# EAGLE design mMicroSD (EAGLE 7.2.0)
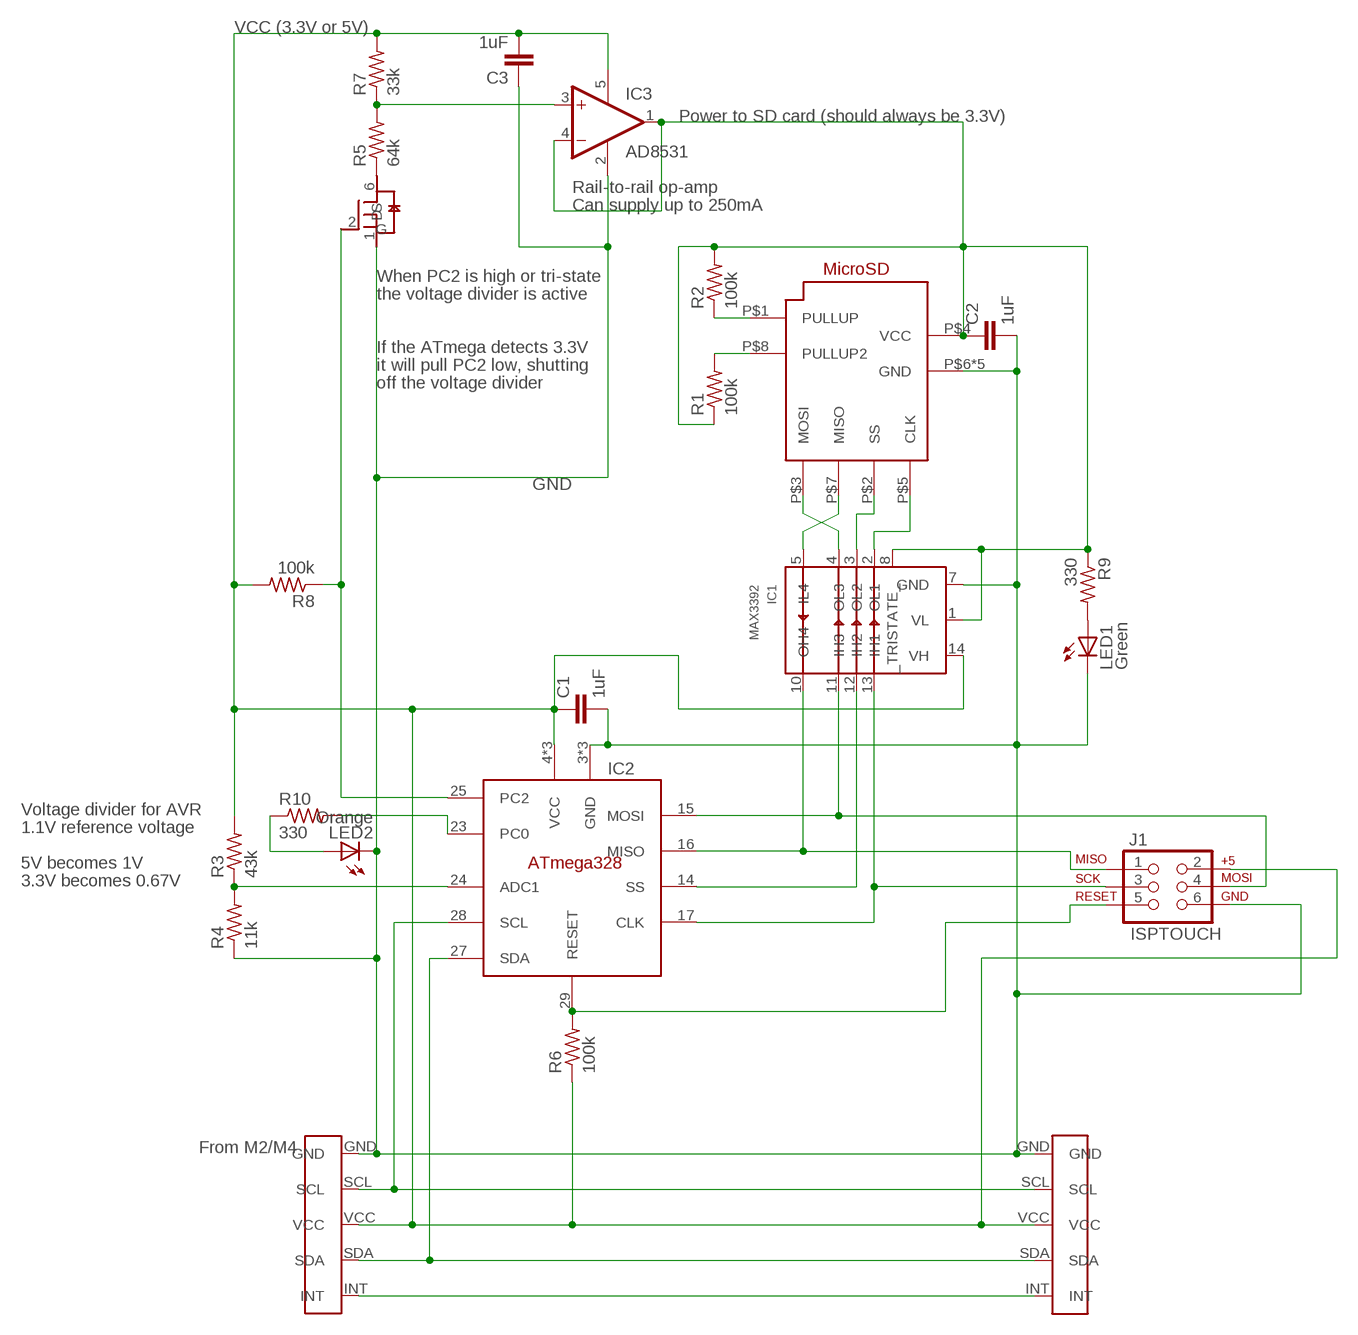
[diagram p0: schematic, sheet 1]

## Parts
C1  1uF  C-EUC0603  [C0603]
C2  1uF  C-EUC0603  [C0603]
C3  1uF  C-EUC0603  [C0603]
IC1  MAX3392  [14-TSSOP]
IC2  ATMEGA328  [ATMEGA328]
IC3  AD8531  [SOT-23-5]
J1  ISPTOUCH  ISPTOUCH_ADAPTER  [AVX_9188_6-WAY_SMT]
LED1  Green  LEDSML0603  [SML0603]
LED2  Orange  LEDSML0603  [SML0603]
M1  NTJD5121N  NTJD5121NT1G  [SOT-363]
R1  100k  R-US_R0603  [R0603]
R2  100k  R-US_R0603  [R0603]
R3  43k  R-US_R0603  [R0603]
R4  11k  R-US_R0603  [R0603]
R5  64k  R-US_R0603  [R0603]
R6  100k  R-US_R0603  [R0603]
R7  33k  R-US_R0603  [R0603]
R8  100k  R-US_R0603  [R0603]
R9  330  R-US_R0603  [R0603]
R10  330  R-US_R0603  [R0603]
SDCONN  101-00660-68-6  [101-00660-68-6]
U$1  MBUS_OUT  [MBUS_OUT]
U$2  MBUS_IN  [MBUS_IN]

## Nets
ADC_LINE: IC2.24(ADC1) R3.1 R4.2
DATA_LED: IC2.23(PC0) R10.2
GATE: IC2.25(PC2) M1.2(G) R8.1
GND: C1.2 C2.2 C3.1 IC1.7(GND) IC2.3(GND) IC2.5(GND) IC2.21(GND) IC3.2(V-) J1.6 LED1.C LED2.C M1.1(S) R4.1 SDCONN.P$6(GND) SDCONN.P$9(GND) SDCONN.P$10(GND) SDCONN.P$11(GND) SDCONN.P$12(GND) U$1.GND U$2.GND
INT: U$1.INT U$2.INT
MISO: IC1.10(OH4) IC2.16(MISO) J1.1
MOSI: IC1.11(IH3) IC2.15(MOSI) J1.4
N$1: M1.6(D) R5.1
N$2: LED1.A R9.2
N$4: LED2.A R10.1
N$12: R1.2 SDCONN.P$8(PULLUP2)
N$13: R2.1 SDCONN.P$1(PULLUP)
OPAMP_VOLTAGE: IC3.3(+IN) R5.2 R7.1
RESET: IC2.29(RESET) J1.5 R6.2
SCK: IC1.13(IH1) IC2.17(CLK) J1.3
SCL: IC2.28(SCL) U$1.SCL U$2.SCL
SD_CS: IC1.3(OL2) SDCONN.P$2(SS)
SD_MISO: IC1.5(IL4) SDCONN.P$7(MISO)
SD_MOSI: IC1.4(OL3) SDCONN.P$3(MOSI)
SD_SCK: IC1.2(OL1) SDCONN.P$5(CLK)
SDA: IC2.27(SDA) U$1.SDA U$2.SDA
SS: IC1.12(IH2) IC2.14(SS)
VCC_MBUS: C1.1 C3.2 IC1.14(VH) IC2.4(VCC) IC2.6(VCC) IC2.18(VCC) IC3.5(V+) J1.2 R3.2 R6.1 R7.2 R8.2 U$1.VCC U$2.VCC
VCC_SD: C2.1 IC1.1(VL) IC1.8(_TRISTATE_) IC3.1(OUT) IC3.4(-IN) R1.1 R2.2 R9.1 SDCONN.P$4(VCC)
Unconnected: M1.3(D) M1.4(S) M1.5(G)

## Notes on the sheet
- VCC (3.3V or 5V)
- Power to SD card (should always be 3.3V)
- Rail-to-rail op-amp
- Can supply up to 250mA
- When PC2 is high or tri-state
- the voltage divider is active
- If the ATmega detects 3.3V
- it will pull PC2 low, shutting
- off the voltage divider
- Voltage divider for AVR
- 1.1V reference voltage
- 5V becomes 1V
- 3.3V becomes 0.67V
- From M2/M4

## Library data of the parts
C1-C3 = resistor:C-EU: CAPACITOR, European symbol
IC1 = haptics:MAX3392: 16Mbps level translator 3 high-to-low 1 low-to-high Min 1.2V Max 5.5V
IC2 = zz-kent:ATMEGA328
IC3 = haptics:AD8531: Rail-to-rail op amp, 2.7V to 6V supply difference, 250mA output
J1 = daspilker_ISPtouch:ISPTOUCH: ISPtouch for AVR Microcontrollers This 6-pin ISP connector for AVR programming does not require any part on the PCB, but an adapter for a common 6-pin programmer. http://daniel-spilker.com/blog/2011/04/25/isptouch-for-avr-microcontrollers/
LED1 LED2 = led:LED: LED OSRAM: - CHIPLED LG R971, LG N971, LY N971, LG Q971, LY Q971, LO R971, LY R971 LH N974, LH R974 LS Q976, LO Q976, LY Q976 LO Q996 - Hyper CHIPLED LW Q18S LB Q993, LB Q99A, LB R99A - SideLED LS A670, LO A670, LY A670, LG A670, LP A670 LB A673, LV A673, LT A673, LW A673 LH A674 LY A675 LS A676, LA A676, LO A676, LY A676, LW A676 LS A679, LY A679, LG A679 - Hyper Micro SIDELED® LS Y876, LA Y876, LO Y876, LY Y876 LT Y87S - SmartLED LW L88C, LW L88S LB L89C, LB L89S, LG L890 LS L89K, LO L89K, LY L89K LS L896, LA L896, LO L896, LY L896 - TOPLED LS T670, LO T670, LY T670, LG T670, LP T670 LSG T670, LSP T670, LSY T670, LOP T670, LYG T670 LG T671, LOG T671, LSG T671 LB T673, LV T673, LT T673, LW T673 LH T674 LS T676, LA T676, LO T676, LY T676, LB T676, LH T676, LSB T676, LW T676 LB T67C, LV T67C, LT T67C, LS T67K, LO T67K, LY T67K, LW E67C LS E67B, LA E67B, LO E67B, LY E67B, LB E67C, LV E67C, LT E67C LW T67C LS T679, LY T679, LG T679 LS T770, LO T770, LY T770, LG T770, LP T770 LB T773, LV T773, LT T773, LW T773 LH T774 LS E675, LA E675, LY E675, LS T675 LS T776, LA T776, LO T776, LY T776, LB T776 LHGB T686 LT T68C, LB T68C - Hyper Mini TOPLED® LB M676 - Mini TOPLED Santana® LG M470 LS M47K, LO M47K, LY M47K Source: http://www.osram.convergy.de LUXEON: - LUMILED® LXK2-PW12-R00, LXK2-PW12-S00, LXK2-PW14-U00, LXK2-PW14-V00 LXK2-PM12-R00, LXK2-PM12-S00, LXK2-PM14-U00 LXK2-PE12-Q00, LXK2-PE12-R00, LXK2-PE12-S00, LXK2-PE14-T00, LXK2-PE14-U00 LXK2-PB12-K00, LXK2-PB12-L00, LXK2-PB12-M00, LXK2-PB14-N00, LXK2-PB14-P00, LXK2-PB14-Q00 LXK2-PR12-L00, LXK2-PR12-M00, LXK2-PR14-Q00, LXK2-PR14-R00 LXK2-PD12-Q00, LXK2-PD12-R00, LXK2-PD12-S00 LXK2-PH12-R00, LXK2-PH12-S00 LXK2-PL12-P00, LXK2-PL12-Q00, LXK2-PL12-R00 Source: www.luxeon.com KINGBRIGHT: KA-3528ASYC Source: www.kingbright.com
M1 = haptics:NTJD5121NT1G: Dual 60V N-channel MOSFETs
R1-R10 = resistor:R-US_: RESISTOR, American symbol
SDCONN = zz-kent:101-00660-68-6: MicroSD connector
U$1 = zz-kent:MBUS_OUT
U$2 = zz-kent:MBUS_IN

## Board
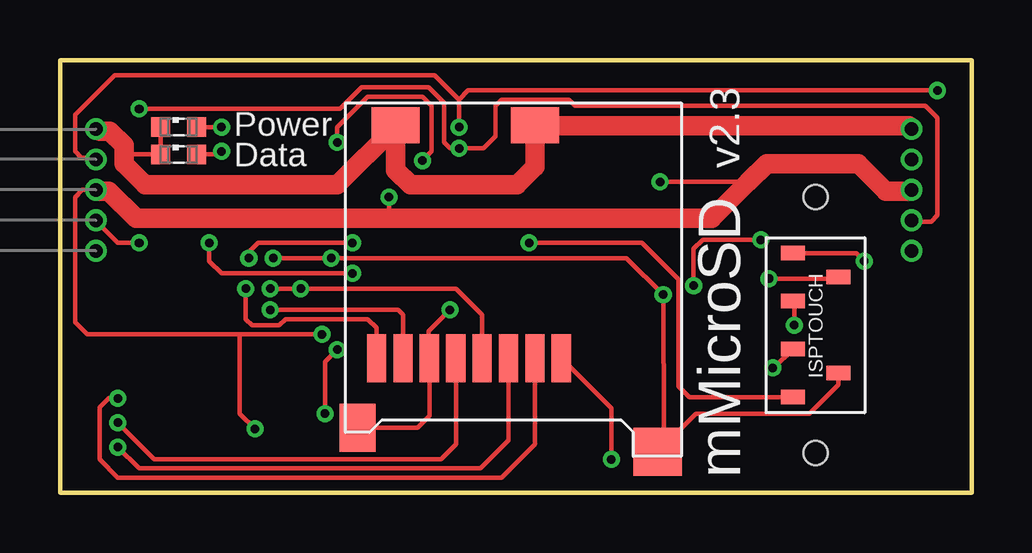
[diagram p1: board, top side]
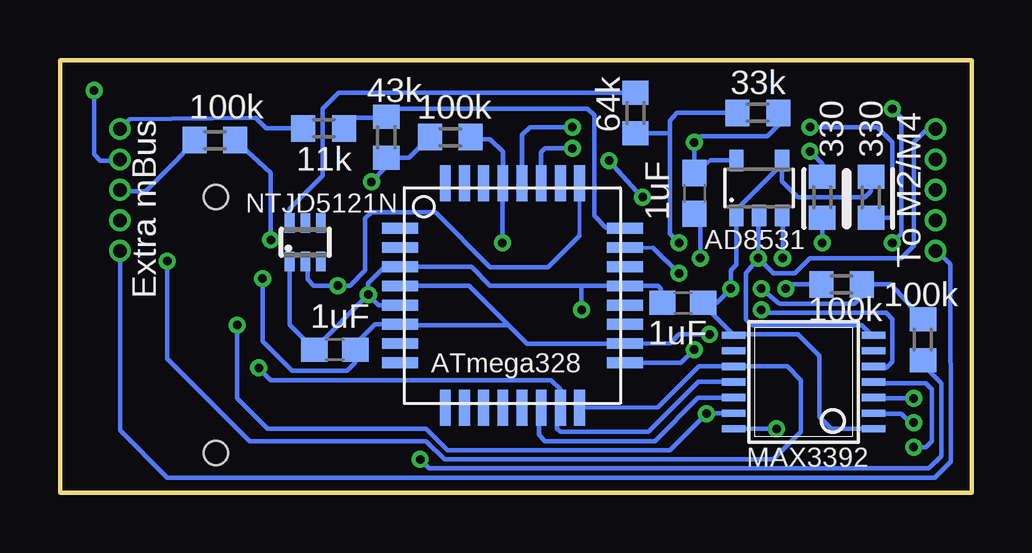
[diagram p2: board, bottom side, seen from below]

Size 38 x 18.03 mm. Coordinates in mm from the lower left corner, seen from the top.
Outline: 0,0 38,0 38,18.03 0,18.03 0,0
Copper layers (1*16): Top 0.0356mm / dielectric 1.5011mm / Bottom 0.0356mm
Design rules "oshpark_eagle_design_rules": minimum track width 6mil, minimum drill 13mil, track to track 6mil, track to pad 6mil, pad to pad 6mil, via to via 6mil, smd to smd 6mil, copper to edge 15mil, drill to drill 6mil, minimum pad ring 7mil, minimum via ring 7mil, stop-mask expansion 4mil, vias tented up to drill 0mil, thermal gap 10mil

### Footprints (pad centres in the part's own frame; a part is rotated, then mirrored left to right if it is on the bottom)
C0603 = smd 1.1 x 1: 1 -0.85,0; 2 0.85,0
14-TSSOP = smd 0.305 x 0.991: 1 -1.95,-2.918; 2 -1.3,-2.918; 3 -0.65,-2.918; 4 0,-2.918; 5 0.65,-2.918; 6 1.3,-2.918; 7 1.95,-2.918; 8 1.95,2.918; 9 1.3,2.918; 10 0.65,2.918; 11 0,2.918; 12 -0.65,2.918; 13 -1.3,2.918; 14 -1.95,2.918
ATMEGA328 = smd 1.5 x 0.45: 1 -4.572,2.91; 2 -4.572,2.11; 3 -4.572,1.31; 4 -4.572,0.51; 5 -4.572,-0.29; 6 -4.572,-1.09; 7 -4.572,-1.89; 8 -4.572,-2.69; 17 4.793,-2.69; 18 4.793,-1.89; 19 4.793,-1.09; 20 4.793,-0.29; 21 4.793,0.51; 22 4.793,1.31; 23 4.793,2.11; 24 4.793,2.91 | smd 0.45 x 1.5: 9 -2.69,-4.572; 10 -1.89,-4.572; 11 -1.09,-4.572; 12 -0.29,-4.572; 13 0.51,-4.572; 14 1.31,-4.572; 15 2.11,-4.572; 16 2.91,-4.572; 25 2.91,4.793; 26 2.11,4.793; 27 1.31,4.793; 28 0.51,4.793; 29 -0.29,4.793; 30 -1.09,4.793; 31 -1.89,4.793; 32 -2.69,4.793
SOT-23-5 = smd 0.6 x 0.9: 1 -0.95,-1.15; 2 0,-1.15; 3 0.95,-1.15; 4 0.95,1.15; 5 -0.95,1.15
AVX_9188_6-WAY_SMT = smd 0.6 x 1: 1 -3,-0.95; 2 -2,0.95; 3 -1,-0.95; 4 1,-0.95; 5 3,-0.95; 6 2,0.95 | hole 1: -5.334,0; 5.334,0
SML0603 = smd 0.8 x 0.8: A 0.75,0; C -0.75,0
SOT-363 = smd 0.4 x 0.8: 1 -0.65,-0.8; 2 0,-0.8; 3 0.65,-0.8; 4 0.65,0.8; 5 0,0.8; 6 -0.65,0.8
R0603 = smd 1 x 1.1: 1 -0.85,0; 2 0.85,0
101-00660-68-6 = smd 2 x 0.8: P$1 4.9,1; P$2 4.9,-0.1; P$3 4.9,-1.2; P$4 4.9,-2.3; P$5 4.9,-3.4; P$6 4.9,-4.5; P$7 4.9,-5.6; P$8 4.9,-6.7 | smd 1.5 x 2: P$9 -4.8,-0.1; P$10 -4.8,-5.9 | smd 2 x 1.5: P$11 7.8,-7.5 | smd 2 x 2.008: P$12 8.8,5.018
MBUS_OUT = drill 0.559 pad 0.762: GND 0,2.54; INT 0,-2.54; SCL 0,1.27; SDA 0,-1.27; VCC 0,0
MBUS_IN = drill 0.559 pad 0.762: GND 0,2.54; INT 0,-2.54; SCL 0,1.27; SDA 0,-1.27; VCC 0,0

### Placement (x,y rotation side)
C1  11.54,12.48 270 bottom
C2  12.04,7.92 180 bottom
C3  26.54,5.97 0 bottom
IC1  7,4.62 90 bottom
IC2  19.25,8.11 0 bottom
IC3  8.85,12.7 0 bottom
J1  31.5,6.99 270 top
LED1  4.95,15.24 0 top
LED2  4.95,14.1 0 top
M1  27.78,10.44 0 bottom
R1  5.41,8.69 180 bottom
R2  2.03,6.38 90 bottom
R3  24.4,14.81 270 bottom
R4  27,15.19 0 bottom
R5  14.01,15.82 270 bottom
R6  21.73,14.82 0 bottom
R7  8.91,15.83 0 bottom
R8  31.54,14.69 180 bottom
R9  4.19,12.32 270 bottom
R10  6.22,12.32 270 bottom
SDCONN  19.9,10.52 270 top
U$1  35.5,12.62 0 top
U$2  1.5,12.62 0 top

### Tracks (layer width: path | path; a pad name or v marks a point on that pad's centre or on a via)
ADC_LINE
  Bottom 0.178: IC2.24 15.24,11.05 15.73,11.54 15.73,15.73 16,16 24.06,16 R3.1 24.44,15.62 25.72,15.62 R4.2
DATA_LED  (via drill 0.36)
  Top 0.178: v6.22,10.41 6.22,9.65 6.73,9.14 v12.19,9.14
  Bottom 0.152: IC2.23 13.27,10.22
  Bottom 0.178: 13.27,10.22 v12.19,9.14 | v6.22,10.41 R10.2
GATE  (via drill 0.36)
  Top 0.178: v29.21,10.54 26.8,10.54 26.42,10.16 v26.42,8.64
  Bottom 0.152: 16.34,10.71 IC2.25
  Bottom 0.178: M1.2 27.69,9.55 27.69,8.89 27.43,8.64 v26.42,8.64 25.91,8.64 25.27,9.27 25.27,11.43 25.02,11.68 22.35,11.68 20.07,9.4 17.65,9.4 16.34,10.71 | v29.21,10.54 29.21,13.34 R8.1
GND  (via drill 0.36)
  Top 0.178: v8.89,9.78 v11.3,9.78 23.62,9.78 v25.15,8.26 25.17,2.52 SDCONN.P$12 26.5,3.3 31.24,3.3 32.45,4.51 J1.6 | v16.26,7.62 15.37,6.73 SDCONN.P$6 15.4,3.21 14.91,2.72 SDCONN.P$11 | 1.67,14.99 U$2.GND | LED1.C LED2.C 2.67,14.1
  Top 0.813: U$1.GND 35.43,15.24 35.39,15.29 19.95,15.29 SDCONN.P$9 19.81,13.59 19.05,12.83 14.61,12.83 14,13.44 SDCONN.P$10 13.97,15.24 11.56,12.83 3.56,12.83 2.67,13.72 2.67,14.1 2.67,14.48 2.08,15.06 1.66,15.06 U$2.GND
  Bottom 0.178: 16.26,8.64 20.07,8.64 20.85,9.42 IC2.3 24.48,9.4 25.15,8.73 v25.15,8.26 | 16.26,8.64 14.57,8.64 IC2.21 14.22,8.64 13.08,8.64 12.95,8.51 12.95,8.24 C2.2 | M1.1 28.43,7 C3.1 27.39,6.01 v25.15,8.26 | R4.1 29.41,15.19 29.84,15.62 35.09,15.56 U$1.GND | v16.26,7.62 16.26,8.64 | IC1.7 4.16,6.57 4.57,6.99 9.14,6.99 9.4,7.24 9.4,9.14 v8.89,9.78 | v8.89,9.78 8.89,11.26 IC3.2 | U$2.GND 1.55,15.11 1.91,15.11 2.41,14.61 2.41,10.29 2.92,9.78 6.73,9.78 7.37,9.14 8.26,9.14 v8.89,9.78 | v11.3,9.78 11.3,11.3 11.56,11.56 11.56,11.61 C1.2 | IC2.5 24.71,7.82 v25.15,8.26
INT
  Bottom 0.178: U$2.INT 1.44,10.08 0.89,9.53 0.86,1.29 1.52,0.64 33.53,0.64 35.5,2.61 U$1.INT
MISO  (via drill 0.36)
  Top 0.178: J1.1 33.2,9.98 v33.53,9.65
  Bottom 0.178: IC2.16 13.08,3.56 11.37,5.27 IC1.10 7.68,5.27 7.11,4.7 7.11,2.54 8.26,1.4 21.97,1.4 22.73,2.16 30.1,2.16 33.53,5.59 v33.53,9.65
MOSI  (via drill 0.36)
  Top 0.178: v29.72,5.21 29.77,5.21 J1.4
  Bottom 0.178: IC1.11 11.38,4.62 13.46,2.54 17.14,2.54 17.27,2.67 17.27,3.91 IC2.15 17.14,4.31 17.53,4.7 29.21,4.7 v29.72,5.21
N$1
  Bottom 0.178: R5.1 26.38,16.68 27.05,16 27.05,13.21 28.43,11.83 M1.6
N$2  (via drill 0.36)
  Top 0.178: v6.73,15.24 LED1.A
  Bottom 0.178: R9.2 3.39,11.47 3.3,11.56 3.3,14.61 3.94,15.24 v6.73,15.24
N$4  (via drill 0.36)
  Top 0.178: v6.73,14.22 6.6,14.1 LED2.A
  Bottom 0.178: R10.1 6.22,13.72 v6.73,14.22
N$12  (via drill 0.36)
  Top 0.178: SDCONN.P$8 13.2,6.87 12.83,7.24 9.4,7.24 9.14,6.99 8,6.99 7.75,7.24 v7.75,8.51
  Bottom 0.178: R1.2 7.54,8.69 v7.75,8.51
N$13  (via drill 0.36)
  Top 0.178: v22.99,1.4 22.99,3.53 SDCONN.P$1
  Bottom 0.178: R2.1 2.04,5.34 1.27,4.57 1.27,1.52 1.78,1.02 22.61,1.02 v22.99,1.4
OPAMP_VOLTAGE  (via drill 0.36)
  Top 0.178: v12.19,10.41 8.26,10.41 7.87,10.03 v7.87,9.78
  Bottom 0.178: 12.57,14.99 12.57,15.49 12.28,15.83 R7.1 | 12.57,14.99 12.57,10.79 v12.19,10.41 | v7.87,9.78 7.87,11.52 IC3.3 | R5.2 12.58,14.97 12.57,14.99
RESET  (via drill 0.36)
  Top 0.178: J1.5 26.24,3.98 25.78,4.45 25.78,8.89 24.26,10.41 v19.56,10.41
  Bottom 0.178: R6.2 20.79,14.73 20.07,14.73 19.54,14.21 IC2.29 19.56,12.88 v19.56,10.41
SCK  (via drill 0.36)
  Top 0.178: v11.05,3.3 11.05,5.46 v11.56,5.97 | v30.61,6.99 30.61,7.92 J1.3
  Bottom 0.178: IC1.13 11.03,3.32 v11.05,3.3 12.57,1.78 21.84,1.78 22.73,2.67 29.34,2.67 30.61,3.94 v30.61,6.99 | IC2.17 12.11,5.42 v11.56,5.97
SCL  (via drill 0.36)
  Top 0.178: v36.58,16.76 17.02,16.76 16.64,16.38 | v16.64,15.24 16.64,16.38 | 16.64,16.38 15.62,17.4 2.29,17.4 0.64,15.75 0.64,14.22 0.89,13.97 1.45,13.97 U$2.SCL
  Bottom 0.178: IC2.28 18.74,14.91 18.41,15.24 v16.64,15.24 | v36.58,16.76 36.58,14.1 36.32,13.84 35.55,13.84 U$1.SCL
SD_CS  (via drill 0.36)
  Top 0.178: SDCONN.P$2 19.8,2.02 18.41,0.64 2.41,0.64 1.65,1.4 1.65,3.56 2.03,3.94 v2.41,3.94
  Bottom 0.178: v2.41,3.94 4.05,3.94 IC1.3
SD_MISO  (via drill 0.36)
  Top 0.178: SDCONN.P$7 14.3,7.42 14.1,7.62 v8.76,7.62
  Bottom 0.178: v8.76,7.62 8.64,7.49 3.56,7.49 3.3,7.24 3.3,5.46 3.56,5.21 3.89,5.21 IC1.5
SD_MOSI  (via drill 0.36)
  Top 0.178: SDCONN.P$3 18.7,2.19 17.53,1.02 3.3,1.02 v2.41,1.91
  Bottom 0.178: v2.41,1.91 1.91,1.91 1.65,2.16 1.65,4.32 1.91,4.57 4.04,4.57 IC1.4
SD_SCK  (via drill 0.36)
  Top 0.178: v2.41,2.92 3.94,1.4 15.88,1.4 16.51,2.03 16.51,5.6 SDCONN.P$5
  Bottom 0.178: v2.41,2.92 2.54,2.92 2.92,3.3 4.07,3.3 IC1.2
SDA  (via drill 0.36)
  Top 0.178: v3.3,16 11.68,16 12.57,16.89 15.37,16.89 16,16.26 16,14.61 16.26,14.35 v16.64,14.35 17.65,14.35 18.16,14.86 18.16,16.13 18.41,16.38 21.21,16.38 21.46,16.13 36.07,16.13 36.58,15.62 36.58,11.56 36.32,11.3 35.55,11.3 U$1.SDA | U$2.SDA 1.48,11.35 2.41,10.41 v3.3,10.41
  Bottom 0.178: IC2.27 17.94,14.19 17.78,14.35 v16.64,14.35 | v3.3,10.41 2.92,10.79 2.92,15.62 v3.3,16
SS
  Bottom 0.178: IC1.12 11.4,3.97 13.21,2.16 17.78,2.16 18.03,2.41 18.03,3.95 IC2.14
VCC_MBUS  (via drill 0.36)
  Top 0.178: v8.13,2.67 7.49,3.3 7.49,6.6 | v13.72,12.32 13.72,11.43 | U$2.VCC 0.94,12.62 0.64,12.32 0.64,7.11 1.14,6.6 7.49,6.6 | v11.56,14.61 11.56,15.24 12.83,16.51 15.11,16.51 15.49,16.13 15.49,14.22 v15.11,13.84 | v10.92,6.6 7.49,6.6 | v29.55,8.93 32.39,8.93 J1.2 | v25.02,12.95 28.7,12.95
  Top 0.813: U$2.VCC 1.6,12.62 1.56,12.57 2.03,12.57 3.17,11.43 13.72,11.43 27.18,11.43 28.7,12.95 29.46,13.72 33.27,13.72 34.42,12.57 35.43,12.57 35.51,12.62 U$1.VCC
  Bottom 0.178: IC1.14 10.04,2.67 v8.13,2.67 | v10.92,6.6 12.19,6.6 12.55,6.22 IC2.18 18.54,6.22 19.3,6.99 | 19.3,6.99 23.79,6.99 IC2.6 24.86,7.02 25.65,6.22 C3.2 25.69,5.42 26.04,5.08 28.32,5.08 29.55,6.31 v29.55,8.93 | 19.3,6.99 20.95,8.64 23.84,8.64 IC2.4 | IC3.5 10.89,13.85 C1.1 v11.55,14.6 | v15.11,13.84 13.97,12.57 v13.72,12.32 | v11.55,14.6 v11.56,14.61 | v11.55,14.6 11.27,14.85 8.51,14.86 8.06,15.31 R7.2 | R6.1 23.44,13.96 R3.2 24.4,13.58 v25.02,12.95 | R8.2 33.15,13.84 34.42,12.57 35.45,12.57 U$1.VCC
VCC_SD  (via drill 0.36)
  Top 0.178: SDCONN.P$4 17.6,7.42 16.51,8.51 v10.03,8.51 v8.76,8.51
  Bottom 0.178: IC1.1 5.84,2.67 6.35,3.17 6.35,5.71 7.24,6.6 9.95,6.6 | 9.95,6.57 IC1.8 9.95,6.6 | 7.9,13.69 IC3.4 7.92,13.84 | 7.9,13.69 9.78,11.81 IC3.1 9.8,9.5 10.03,9.27 v10.03,8.51 10.62,7.92 C2.1 11.19,7.84 9.95,6.6 | R1.1 4.06,8.69 | 4.06,8.69 3.36,8.69 R2.2 | v8.76,8.51 8,7.87 4.88,7.87 4.06,8.69 | 7.9,13.69 7.9,12.98 7.24,12.32 4.45,12.32 4.19,12.57 R9.1

### Text on the board
tPlace: Power | Data | v2.3 | mMicroSD
bPlace: To M2/M4 | Extra mBus